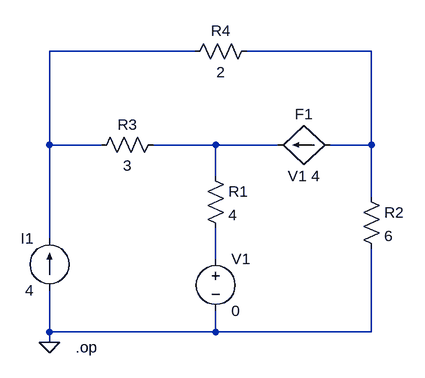
[diagram p0: schematic CH03-KP2-12.asc]
CH03-KP2-12.asc, the LTspice schematic file:
Version 4
SHEET 1 880 680
WIRE 112 96 -112 96
WIRE 384 96 192 96
WIRE -112 240 -112 96
WIRE -32 240 -112 240
WIRE 144 240 48 240
WIRE 240 240 144 240
WIRE 384 240 384 96
WIRE 384 240 320 240
WIRE 144 288 144 240
WIRE 384 320 384 240
WIRE -112 384 -112 240
WIRE 144 416 144 368
WIRE -112 528 -112 464
WIRE 144 528 144 496
WIRE 144 528 -112 528
WIRE 384 528 384 400
WIRE 384 528 144 528
WIRE -112 544 -112 528
FLAG -112 544 0
DATAFLAG -112 240 "$"
DATAFLAG 144 240 "$"
DATAFLAG 384 240 "$"
SYMBOL res 128 272 R0
SYMATTR InstName R1
SYMATTR Value 4
SYMBOL res 368 304 R0
SYMATTR InstName R2
SYMATTR Value 6
SYMBOL res 64 224 R90
WINDOW 0 0 56 VBottom 2
WINDOW 3 32 56 VTop 2
SYMATTR InstName R3
SYMATTR Value 3
SYMBOL res 208 80 R90
WINDOW 0 0 56 VBottom 2
WINDOW 3 32 56 VTop 2
SYMATTR InstName R4
SYMATTR Value 2
SYMBOL current -112 464 R180
WINDOW 0 24 80 Left 2
WINDOW 3 24 0 Left 2
SYMATTR InstName I1
SYMATTR Value 4
SYMBOL voltage 144 400 R0
SYMATTR InstName V1
SYMATTR Value 0
SYMBOL f 320 240 R90
WINDOW 0 -32 40 VBottom 2
WINDOW 3 32 40 VTop 2
SYMATTR InstName F1
SYMATTR Value V1 4
TEXT -72 552 Left 2 !.op

The netlist it stands for:
* CH03-KP2-12.asc
R1 N003 N004 4
R2 N002 0 6
R3 N003 N001 3
R4 N002 N001 2
I1 0 N001 4
V1 N004 0 0
F1 N002 N003 V1 4
.op
.backanno
.end